# Altium schematic sheet 3_TB6612（2）.schdoc.schdoc
size 309 x 223 mm; Symbol: Sheet-Symbol_A4; Device: Sheet-Symbol_A4; Company: 嘉立创EDA; Drawed: 吴登珂; Version: V1.0; Page Size: A4; @Project Name: TB6612; @Page Count: 4; @Update Date: 2024-04-14; @Create Date: 2024-04-14; @Schematic Name: Schematic1; @Page No: 2; @Page Name: TB6612（2）
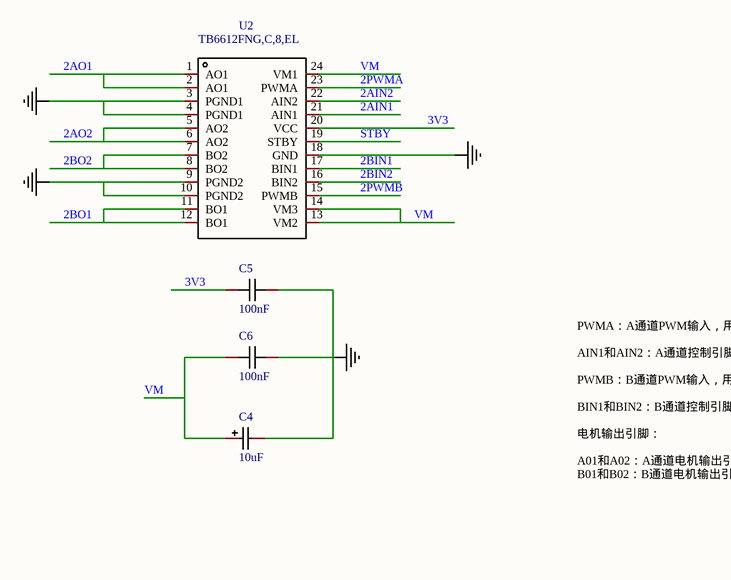
[diagram p0: 3_TB6612（2）.schdoc.schdoc]

## Parts
C4  10uF  [CAP-SMD_L3.5-W2.8-R-RD]
C5  100nF  [C0603]
C6  100nF  [C0603]
U2  TB6612FNG,C,8,EL  [SSOP-24_L8.3-W5.6-P0.65-LS7.6-BL]

## Nets
NetC4_2: C4.2 C5.2 C6.2 U2.3(PGND1) U2.4(PGND1) U2.9(PGND2) U2.10(PGND2) U2.18(GND)
2AIN1: U2.21(AIN1)
2AIN2: U2.22(AIN2)
2AO1: U2.1(AO1) U2.2(AO1)
2AO2: U2.5(AO2) U2.6(AO2)
2BIN1: U2.17(BIN1)
2BIN2: U2.16(BIN2)
2BO1: U2.11(BO1) U2.12(BO1)
2BO2: U2.7(BO2) U2.8(BO2)
2PWMA: U2.23(PWMA)
2PWMB: U2.15(PWMB)
3V3: C5.1 U2.20(VCC)
STBY: U2.19(STBY)
VM: C4.1 C6.1 U2.13(VM2) U2.14(VM3) U2.24(VM1)

## Notes on the sheet
- PWMA：A通道PWM输入，用于控制A通道电机的速度。
  AIN1和AIN2：A通道控制引脚，用于控制A通道电机的方向。
  PWMB：B通道PWM输入，用于控制B通道电机的速度。
  BIN1和BIN2：B通道控制引脚，用于控制B通道电机的方向。
- 电机输出引脚：
  A01和A02：A通道电机输出引脚。
  B01和B02：B通道电机输出引脚。
- 1
- 2
- 3
- 4
- 5
- 6
- A
- B
- C
- 原理图
- Schematic1
- 创建日期
- 更新日期
- 2024-04-14
- 审阅
- 绘制
- 图页
- 吴登珂
- TB6612（2）
- 物料编码
- TB6612
- D
- 版本
- 尺寸
- 页
- 共
- V1.0
- A4
- 嘉立创EDA

## Library data of the parts
C4 = TAJB106K025RNJ: Manufacturer: Kyocera AVX; Add into BOM: yes; Tolerance: ±10%; Rated Voltage: 25V; Equivalent Series Resistance(ESR): 2.5Ω@100kHz; Description: 容值:10uF;精度:±10%;额定电压:25V;等效串联电阻:2.5Ω@100kHz;; Name: 10uF; Symbol: TAJB106K025RNJ; Device: TAJB106K025RNJ; LCSC Part Name: 10uF ±10% 25V; Supplier Part: C7194; Manufacturer Part: TAJB106K025RNJ; Supplier Footprint: CASE-B-3528; JLCPCB Part Class: 扩展库; Datasheet: https://atta.szlcsc.com/upload/public/pdf/source/20160107/1457707750344.pdf; Supplier: LCSC; Convert to PCB: yes; Value: 10uF; Operating Temperature: -55℃~+125℃
C5 C6 = CAP_0603: Symbol: CapAcitance; Convert to PCB: yes; Name: 100nF; Device: CAP_0603; Add into BOM: yes; Supplier Footprint: 0603; Value: 100nF
U2 = TB6612FNG,C,8,EL: Manufacturer: TOSHIBA(东芝); Add into BOM: yes; Drive motor type: 有刷直流电机; Supply Voltage: 2.7V~5.5V; Output Current: 1A; Interface: 并行; Description: 驱动电机类型:有刷直流电机;电源电压:2.7V~5.5V;输出电流:1A;接口:并行;; Name: TB6612FNG,C,8,EL; Symbol: TB6612FNG,C,8,EL; Device: TB6612FNG,C,8,EL; LCSC Part Name: 1A 有刷直流电机驱动芯片 5.5V; Supplier Part: C141517; Manufacturer Part: TB6612FNG,C,8,EL; Supplier Footprint: SSOP-24; JLCPCB Part Class: 扩展库; Datasheet: https://atta.szlcsc.com/upload/public/pdf/source/20171128/C141517_15118625624231147036.pdf; Supplier: LCSC; Convert to PCB: yes; Operating Temperature: -20℃~+85℃@(Ta)